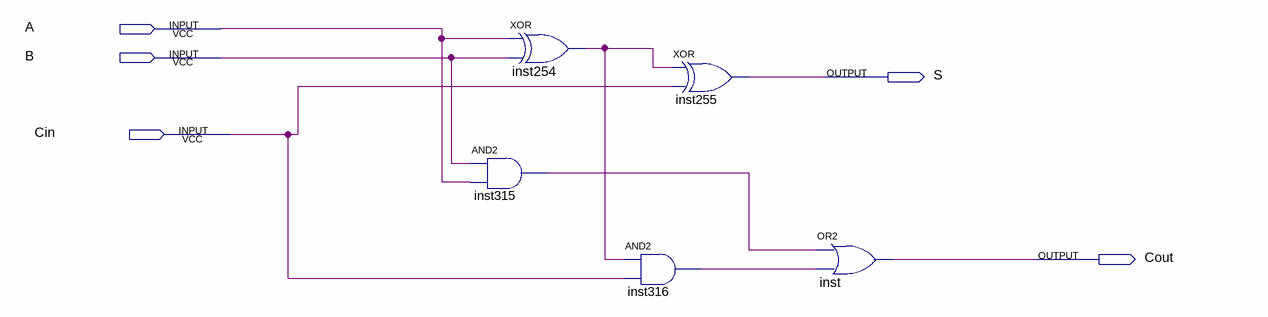
[diagram p0: schematic sheet]
// Quartus schematic Block2.bdf as structural Verilog: 5 symbols, 5 pins
module Block2 (
  input  A,
  input  B,
  input  Cin,
  output S,
  output Cout
);

  wire inst254_out, inst315_out, inst316_out;

  xor inst254 (inst254_out, A, B);
  and inst315 (inst315_out, B, A);
  and inst316 (inst316_out, inst254_out, Cin);
  xor inst255 (S, inst254_out, Cin);
  or inst (Cout, inst315_out, inst316_out);
endmodule
